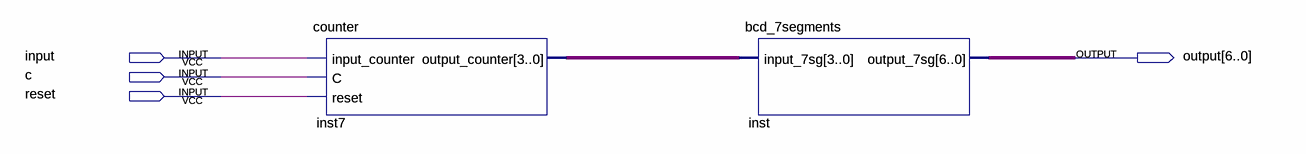
[diagram p0: schematic sheet]
// Quartus schematic PROJET_AFFICHEUR_afficher_counter.bdf as structural Verilog: 4 symbols, 8 pins
module PROJET_AFFICHEUR_afficher_counter (
  input  \input ,
  input  c,
  input  reset,
  output [6:0] \output 
);

  wire [3:0] inst7_output_counter;

  counter inst7 (.input_counter(\input ), .C(c), .reset(reset), .output_counter(inst7_output_counter));
  counter inst7_dup2 (.input_counter(\input ), .C(c), .reset(reset), .output_counter(inst7_output_counter));
  bcd_7segments inst (.input_7sg(inst7_output_counter), .output_7sg(\output ));
  bcd_7segments inst_dup2 (.input_7sg(inst7_output_counter), .output_7sg(\output ));
endmodule
